# Altium schematic sheet Brightness_Sensor_Schematic.SchDoc
size A4; SheetNumber: 2; SheetTotal: 2
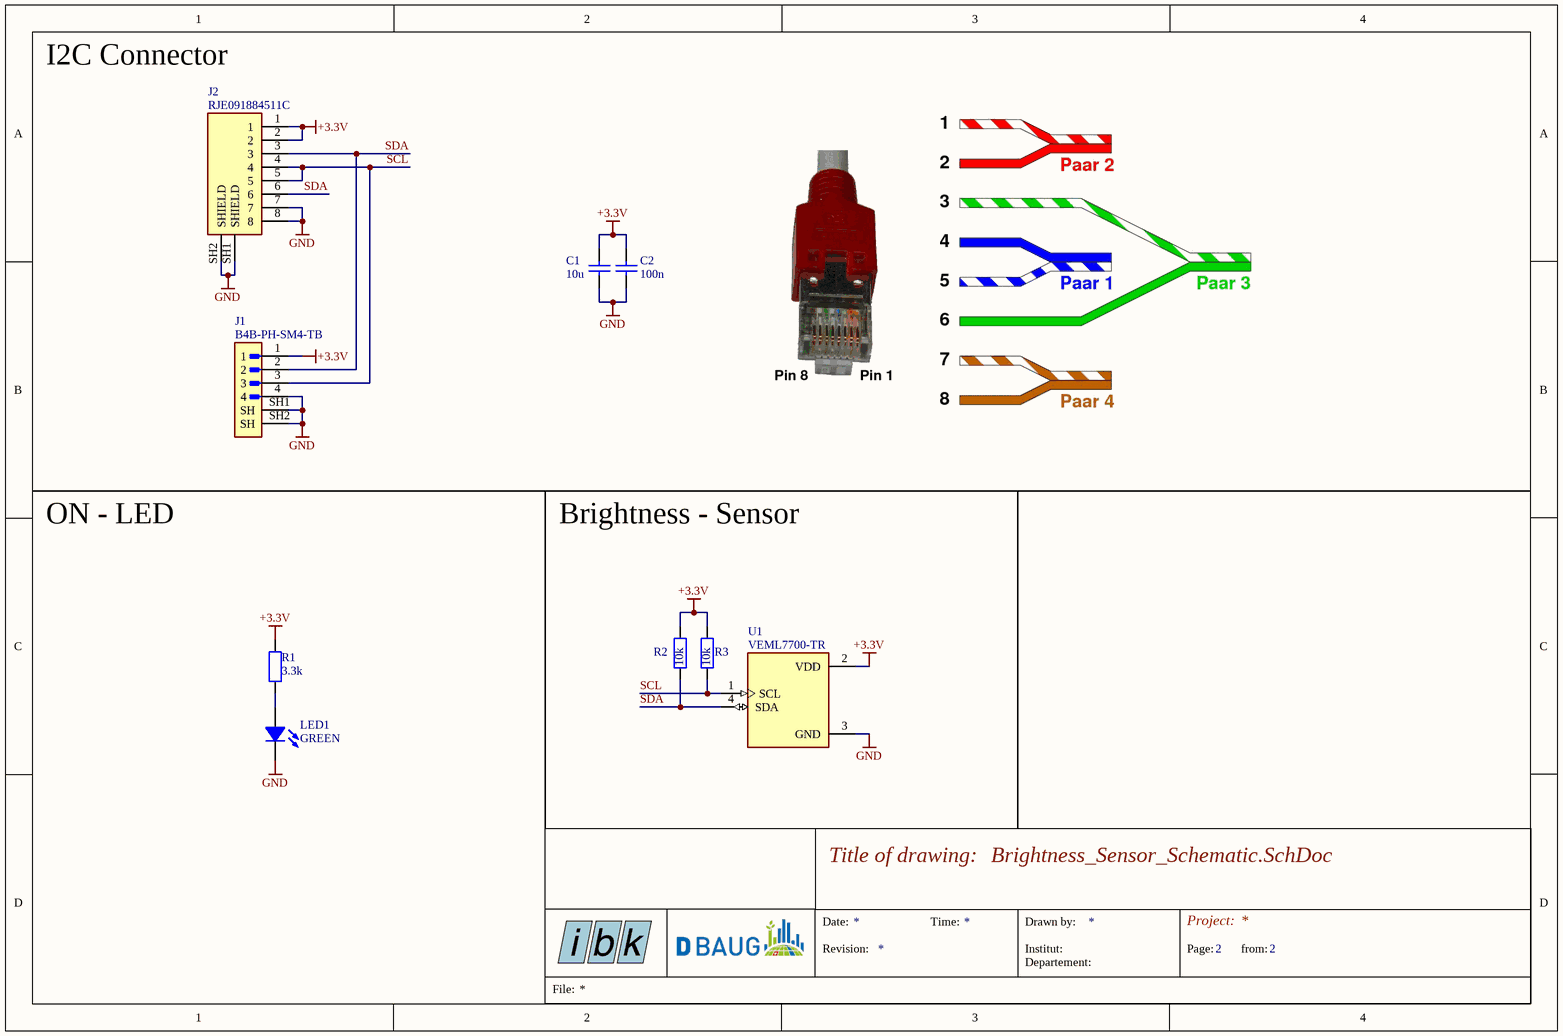
[diagram p0: Brightness_Sensor_Schematic.SchDoc]

## Parts
C1  10u  [0603_CAPACITOR]
C2  100n  [0603_CAPACITOR]
J1  B4B-PH-SM4-TB  [Connector_SMD]
J2  RJE091884511C  [RJ45]
LED1  GREEN  [LED_0603, GREEN]
R1  3.3k  [0603_Resistor]
R2  10k  [0603_Resistor]
R3  10k  [0603_Resistor]
U1  VEML7700-TR  [Brightness_Sensor]

## Nets
+3.3V: C1.2 C2.2 J1.1 J2.1 J2.2 R1.2 R2.2 R3.2 U1.2(VDD)
GND: C1.1 C2.1 J1.4 J1.SH1(SH) J1.SH2(SH) J2.7 J2.8 J2.SH1(SHIELD) J2.SH2(SHIELD) LED1.K U1.3(GND)
SCL: J1.3 J2.4 J2.5 R3.1 U1.1(SCL)
SDA: J1.2 J2.3 J2.6 R2.1 U1.4(SDA)
NetLED1_A: LED1.A R1.1

## Notes on the sheet
- I2C Connector
- ON - LED
- Brightness - Sensor
- Date:
- Title of drawing:
- Time:
- Drawn by:
- Project:
- Revision:
- Institut:
- Departement:
- Page:
- from:
- File:

## Library data of the parts
C1 C2 = Capacitor: 0603
J1 = Connector_SMD_Small_Symbol: CONN HEADER SMD 4POS 2MM.; ComponentLink1Description: Supplier; ComponentLink1URL: https://www.digikey.ch/en/products/detail/jst-sales-america-inc/B4B-PH-SM4-TB/926643
J2 = RJ45: Jack Modular Connector 8p8c (RJ45, Ethernet) 90Â° Angle (Right) Shielded Cat3.; MF: Amphenol ICC (Commercial Products); SnapEDA_Link: https://www.snapeda.com/parts/RJE091884511C/Amphenol/view-part/?ref=snap; Package: None; System: Connector; MP: RJE091884511C; Check_prices: https://www.snapeda.com/parts/RJE091884511C/Amphenol/view-part/?ref=eda; Parameter 1: *
LED1 = LED_0603, GREEN: LED 0603, Green, 3.2 V, 20 mA, 430 mcd
R1-R3 = Resistor: 0603
U1 = Brightness_Sensor: SENSOR OPT 545NMAMB 4 SMD J LEAD.; ComponentLink1Description: Supplier; ComponentLink1URL: https://www.digikey.ch/en/products/detail/vishay-semiconductor-opto-division/VEML7700-TR/5820243